# EAGLE schematic Lasermodul (EAGLE 7.2.0)
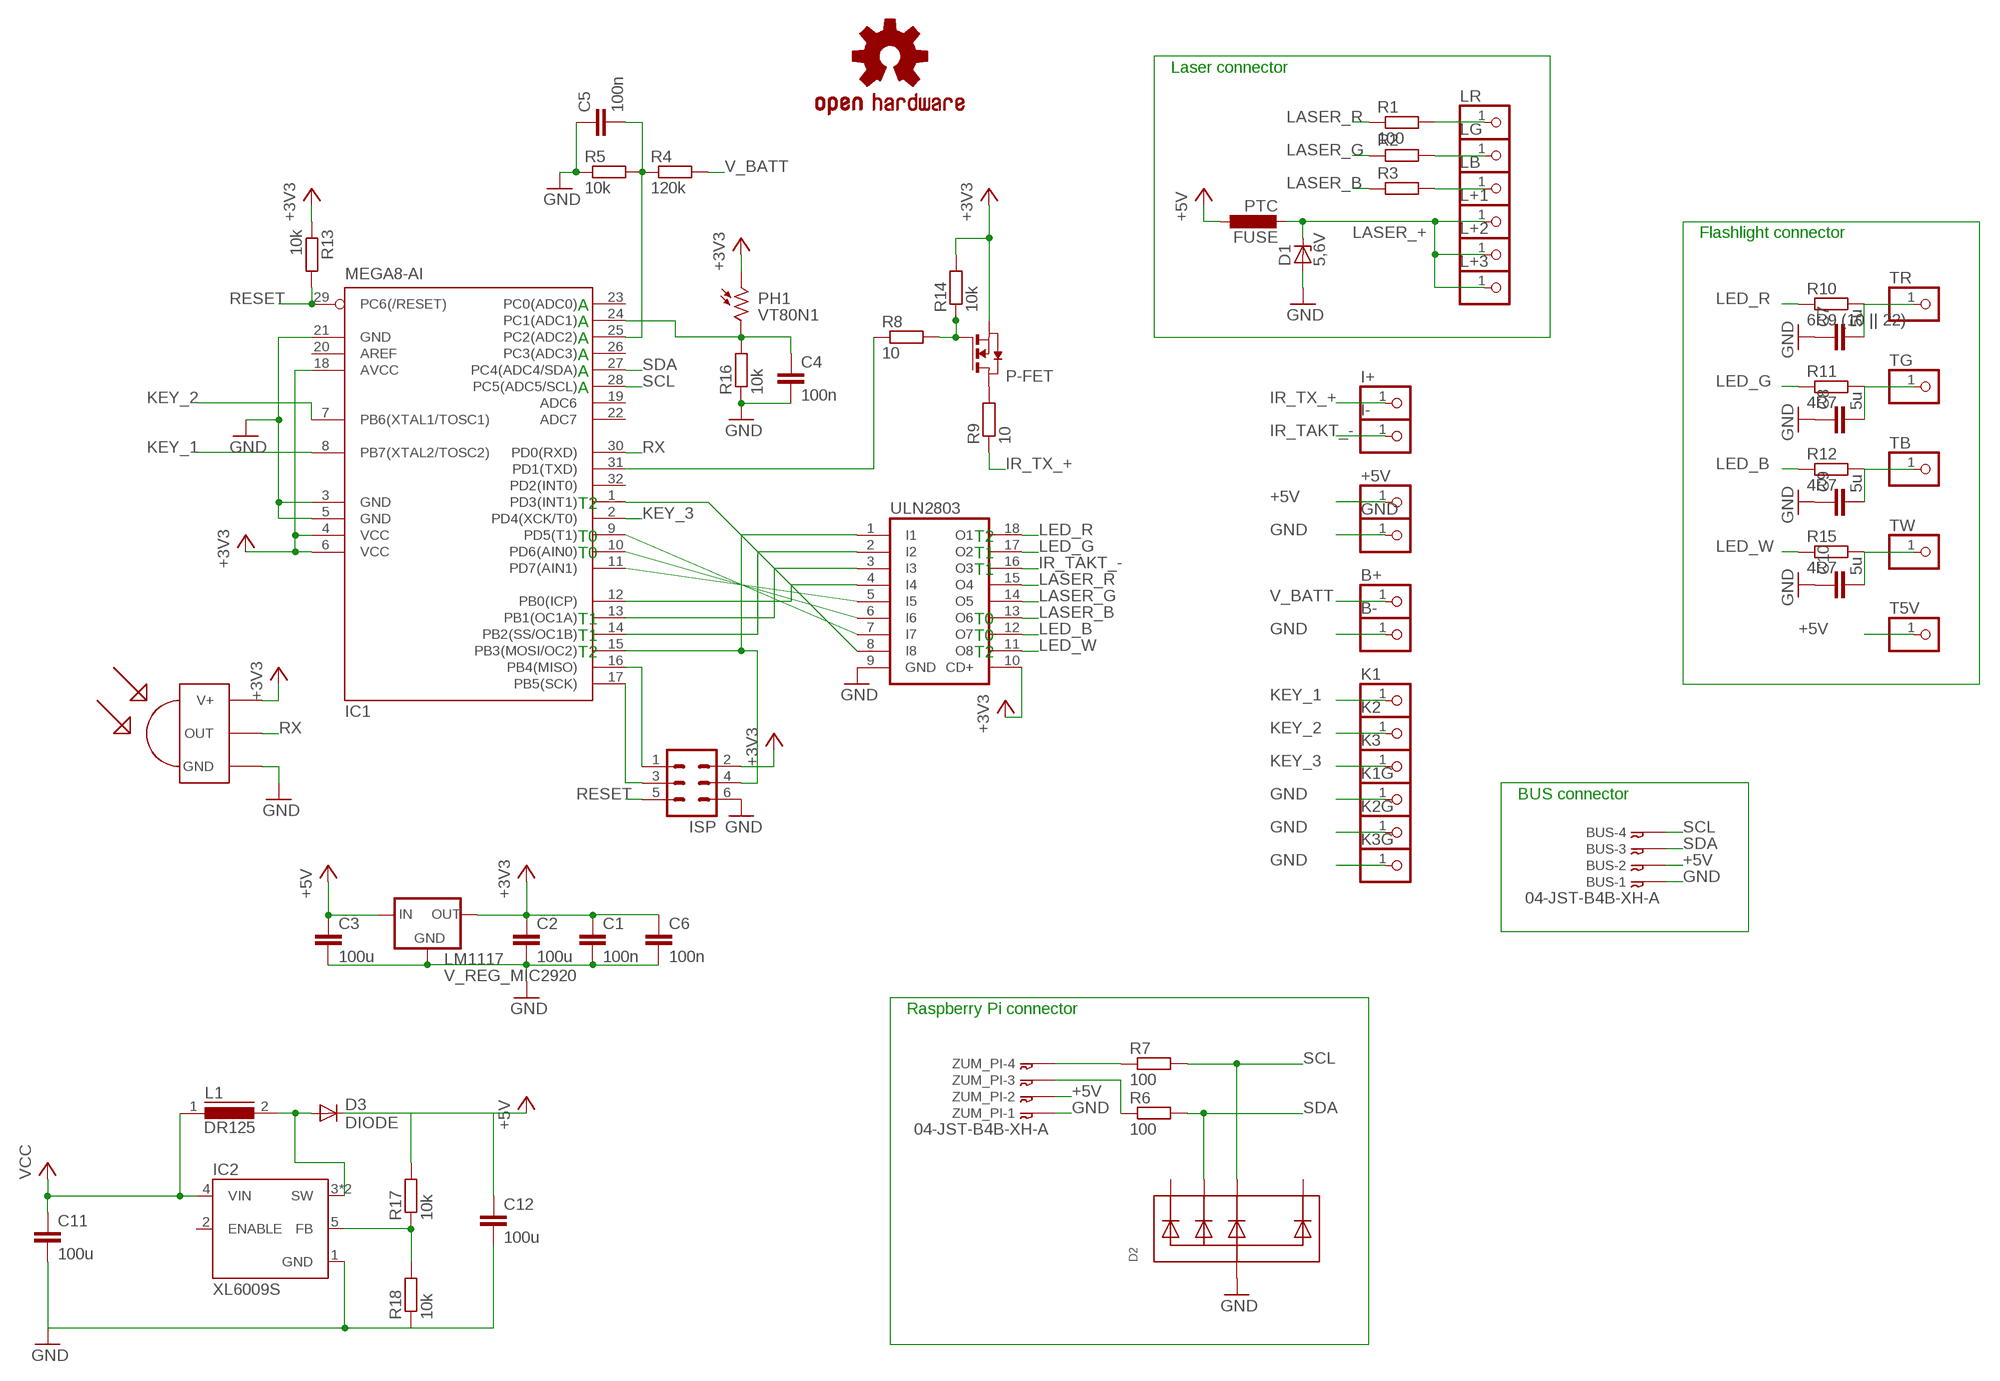
[diagram p0: schematic, sheet 1]

## Parts
+5V  PINHD-1X1  [1X01]
B+  PINHD-1X1  [1X01]
B-  PINHD-1X1  [1X01]
BUS  04-JST-B4B-XH-A  [B4B-XH]
C1  100n  C-EUC0805  [C0805]
C2  100u  C-EUC1808  [C1808]
C3  100u  C-EUC1808  [C1808]
C4  100n  C-EUC0805  [C0805]
C5  100n  C-EUC0805  [C0805]
C6  100n  C-EUC0805  [C0805]
C7  5u  C-EUC0805  [C0805]
C8  5u  C-EUC0805  [C0805]
C9  5u  C-EUC0805  [C0805]
C10  5u  C-EUC0805  [C0805]
C11  100u  C-EUC1808  [C1808]
C12  100u  C-EUC1808  [C1808]
D1  5,6V  BZY97  [F126Z12]
D2  TVSARRAY_5LANE  [SOT363]
D3  DIODE  [DIODE]
FUSE  PTC  L-EUL1812  [L1812]
GND  PINHD-1X1  [1X01]
I+  PINHD-1X1  [1X01]
I-  PINHD-1X1  [1X01]
IC1  MEGA8-AI  [TQFP32-08]
IC2  XL6009S  [TO263-5]
ISP  MA03-2  [MA03-2]
K1  PINHD-1X1  [1X01]
K1G  PINHD-1X1  [1X01]
K2  PINHD-1X1  [1X01]
K2G  PINHD-1X1  [1X01]
K3  PINHD-1X1  [1X01]
K3G  PINHD-1X1  [1X01]
L1  DR125  [DR125]
L+1  PINHD-1X1  [1X01]
L+2  PINHD-1X1  [1X01]
L+3  PINHD-1X1  [1X01]
LB  PINHD-1X1  [1X01]
LG  PINHD-1X1  [1X01]
LM1117  V_REG_MIC2920  [SOT223]
LOGO1  OSHW-LOGOM  [OSHW-LOGO-M]
LR  PINHD-1X1  [1X01]
P-FET  NMOSSOT23  [SOT-23]
PH1  VT80N1  [VT800]
R1  100  R-EU_R0805  [R0805]
R2  R-EU_R0805  [R0805]
R3  R-EU_R0805  [R0805]
R4  120k  R-EU_R0805  [R0805]
R5  10k  R-EU_R0805  [R0805]
R6  100  R-EU_R0805  [R0805]
R7  100  R-EU_R0805  [R0805]
R8  10  R-EU_R0805  [R0805]
R9  10  R-EU_R0805  [R0805]
R10  6R9 (10 || 22)  R-EU_R0805  [R0805]
R11  4R7  R-EU_R0805  [R0805]
R12  4R7  R-EU_R0805  [R0805]
R13  10k  R-EU_R0805  [R0805]
R14  10k  R-EU_R0805  [R0805]
R15  4R7  R-EU_R0805  [R0805]
R16  10k  R-EU_R0805  [R0805]
R17  10k  R-EU_R0805  [R0805]
R18  10k  R-EU_R0805  [R0805]
T5V  PINHD-1X1  [1X01]
TB  PINHD-1X1  [1X01]
TG  PINHD-1X1  [1X01]
TR  PINHD-1X1  [1X01]
TW  PINHD-1X1  [1X01]
U$1  TSOP1838  [TSOP18XX]
ULN2803  ULN2803ASO18  [SO18W]
ZUM_PI  04-JST-B4B-XH-A  [B4B-XH]

## Nets
+3V3: C1.1 C2.1 C6.1 IC1.4(VCC) IC1.6(VCC) IC1.18(AVCC) ISP.2 LM1117.2(OUT) LM1117.4(OUT) P-FET.2(S) PH1.1 R13.1 R14.2 U$1.VCC(V+) ULN2803.10(CD+)
+5V: +5V.1 BUS.P$2 C3.1 C12.1 D3.C FUSE.1 LM1117.3(IN) R17.2 T5V.1 ZUM_PI.P$2
GND: B-.1 BUS.P$1 C1.2 C2.2 C3.2 C4.2 C5.1 C6.2 C7.1 C8.1 C9.1 C10.1 C11.2 C12.2 D1.A D2.2(A) GND.1 IC1.3(GND) IC1.5(GND) IC1.21(GND) IC2.1(GND) ISP.6 K1G.1 K2G.1 K3G.1 LM1117.1(GND) R5.1 R16.1 R18.1 U$1.GND ULN2803.9(GND) ZUM_PI.P$1
IR_TAKT_-: I-.1 ULN2803.16(O3)
IR_TX_+: I+.1 R9.1
KEY_1: IC1.8(PB7(XTAL2/TOSC2)) K1.1
KEY_2: IC1.7(PB6(XTAL1/TOSC1)) K2.1
KEY_3: IC1.2(PD4(XCK/T0)) K3.1
LASER_+: D1.C FUSE.2 L+1.1 L+2.1 L+3.1
LASER_B: R3.1 ULN2803.13(O6)
LASER_G: R2.1 ULN2803.14(O5)
LASER_R: R1.1 ULN2803.15(O4)
LED_B: R12.1 ULN2803.12(O7)
LED_G: R11.1 ULN2803.17(O2)
LED_R: R10.1 ULN2803.18(O1)
LED_W: R15.1 ULN2803.11(O8)
N$1: IC1.15(PB3(MOSI/OC2)) ISP.4 ULN2803.1(I1)
N$2: IC1.14(PB2(SS/OC1B)) ULN2803.2(I2)
N$3: IC1.13(PB1(OC1A)) ULN2803.3(I3)
N$4: IC1.12(PB0(ICP)) ULN2803.4(I4)
N$7: IC1.11(PD7(AIN1)) ULN2803.5(I5)
N$8: IC1.1(PD3(INT1)) ULN2803.8(I8)
N$9: IC1.10(PD6(AIN0)) ULN2803.6(I6)
N$10: IC1.9(PD5(T1)) ULN2803.7(I7)
N$11: IC1.16(PB4(MISO)) ISP.1
N$12: LR.1 R1.2
N$13: IC1.17(PB5(SCK)) ISP.3
N$14: C5.2 IC1.25(PC2(ADC2)) R4.1 R5.2
N$15: C7.2 R10.2 TR.1
N$16: P-FET.1(D) R9.2
N$17: IC1.31(PD1(TXD)) R8.1
N$18: LG.1 R2.2
N$19: LB.1 R3.2
N$20: P-FET.3(G) R8.2 R14.1
N$21: C8.2 R11.2 TG.1
N$22: C9.2 R12.2 TB.1
N$23: C10.2 R15.2 TW.1
N$26: C4.1 IC1.24(PC1(ADC1)) PH1.2 R16.2
N$27: R7.1 ZUM_PI.P$4
N$28: R6.1 ZUM_PI.P$3
N$34: IC2.5(FB) R17.1 R18.2
N$36: D3.A IC2.3(SW) IC2.6(SW) L1.2
RESET: IC1.29(PC6(/RESET)) ISP.5 R13.2
RX: IC1.30(PD0(RXD)) U$1.OUT
SCL: BUS.P$4 D2.4(C3) IC1.28(PC5(ADC5/SCL)) R7.2
SDA: BUS.P$3 D2.3(C2) IC1.27(PC4(ADC4/SDA)) R6.2
V_BATT: B+.1 R4.2
VCC: C11.1 IC2.4(VIN) L1.1
Unconnected: D2.1(C1) D2.6(C5) IC1.19(ADC6) IC1.20(AREF) IC1.22(ADC7) IC1.23(PC0(ADC0)) IC1.26(PC3(ADC3)) IC1.32(PD2(INT0)) IC2.2(ENABLE)

## Notes on the sheet
- Laser connector
- Flashlight connector
- A
- A
- A
- A
- A
- A
- T2
- T0 | T2
- T0 | T1
- T1
- T1 | T0
- T1 | T0
- T2 | T2
- BUS connector
- Raspberry Pi connector

## Library data of the parts
+5V B+ B- GND I+ I- K1 K1G K2 K2G K3 K3G L+1-L+3 LB LG LR T5V TB TG TR TW = wz:PINHD-1X1: PIN HEADER
BUS ZUM_PI = wz:04-JST: JST CONNECTOR
C1 C4 C5 C7-C10 = wz:C-EU: CAPACITOR, European symbol
C2 C3 C11 C12 = wz_c:C-EU: CAPACITOR, European symbol
C6 = rcl:C-EU: CAPACITOR, European symbol
D1 = wz:BZY97: Z DIODE
D2 = wz:TVSARRAY_5LANE: Voltage Transient Suppressor Array SOT363 SMF05C - 100W 5V: Digikey - SMF05CT1GOSCT-ND
D3 = wz:DIODE: DIODE super fast rectifier, 2 A
FUSE = resistor:L-EU: INDUCTOR, European symbol
IC1 = atmel:MEGA8: MICROCONTROLLER 8 Kbytes FLASH, 1 kbytes SRAM, 512 bytes EEPROM, USART, 6-channel 10 bit ADC, 2-channel 8 bit ADC Pin compatible with Atmega48, ATMega88, ATMega168 Source: avr.lbr; MPN: ATMEGA8-16AU; OC_FARNELL: 9171371; OC_NEWARK: 73M8863
IC2 = wz:XL6009: son china lm2577 clon. nicht pin kompatibel!
ISP = con-lstb:MA03-2: PIN HEADER; OC_FARNELL: unknown; OC_NEWARK: unknown
L1 = inductors:DR125: High Power Density, High Efficiency, Shielded Inductors Source: coiltronics_dr_series.pdf
LM1117 = wz:V_REG_MIC2920: MIC2920A (http://www.micrel.com/_PDF/mic2920.pdf) - 400mA output LDO Regulator
LOGO1 = wz:OSHW-LOGO: Open Source Hardware Logo This logo indicates the piece of hardware it is found on incorporates a OSHW license and/or adheres to the definition of open source hardware found here: http://freedomdefined.org/OSHW
P-FET = zetex:NMOSSOT23: MOS FET; OC_FARNELL: unknown; OC_NEWARK: unknown
PH1 = photo-elements:VT8: Photoconductive Cell VT800 Series Source: http://optoelectronics.perkinelmer.com/content/Datasheets/DTS_vt800seriesdatasheet.pdf
R1-R3 R6-R15 R17 R18 = rcl:R-EU_: RESISTOR, European symbol
R4 R5 R16 = wz:R-EU_: RESISTOR, European symbol
U$1 = tsop:TSOP1838: IR Receiver and Demodulator
ULN2803 = wz:ULN2803A: DRIVER ARRAY

## Net classes
0 default: width 0.016 mm